# EAGLE design Adafruit RGB Matrix Bonnet (EAGLE 6.4)
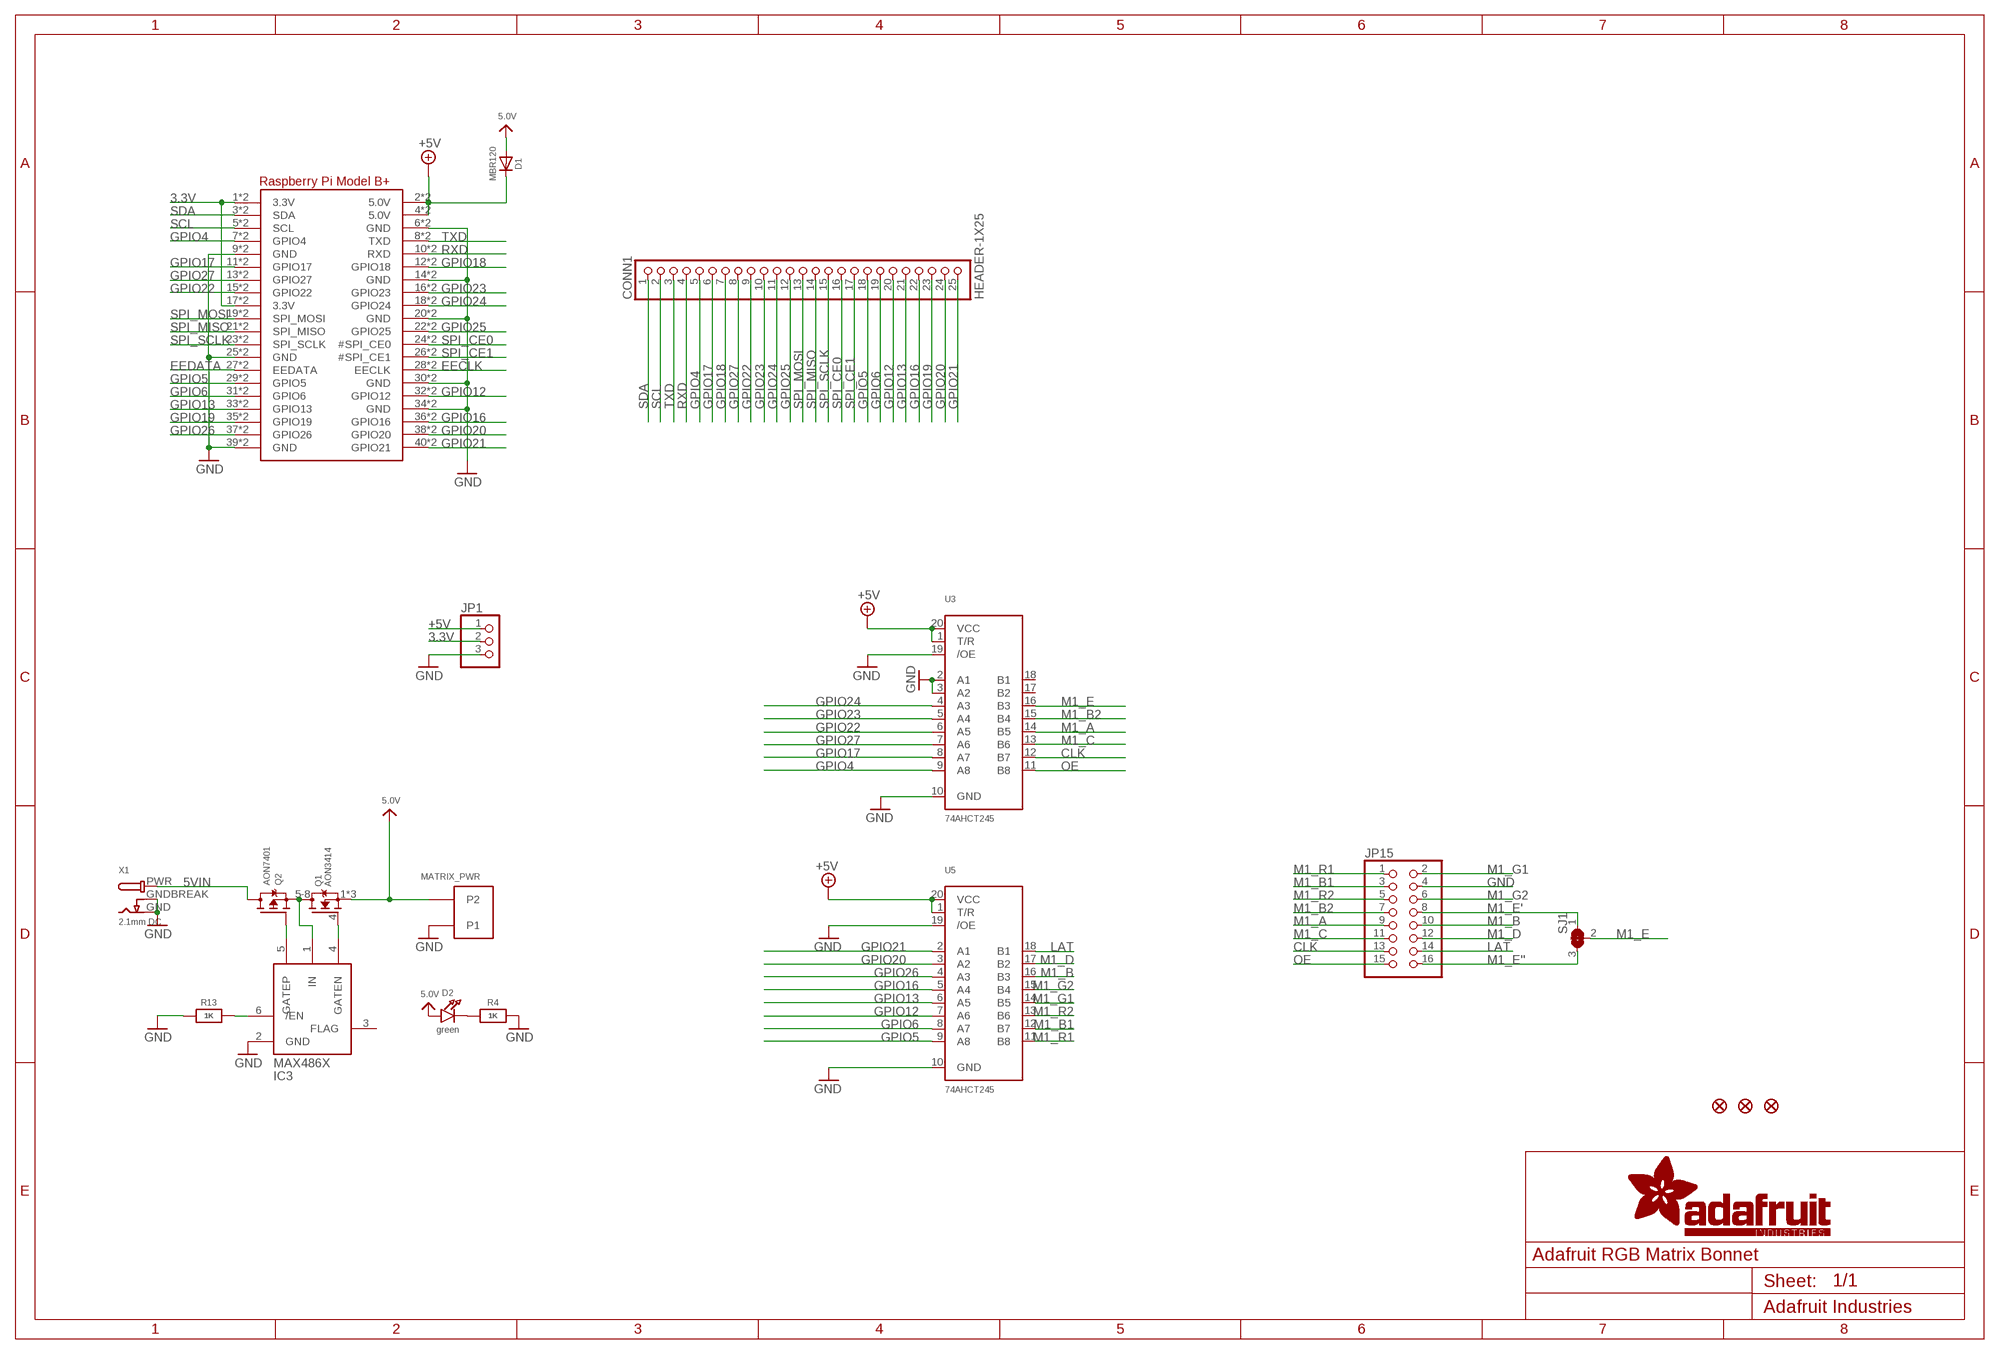
[diagram p0: schematic, sheet 1]

## Parts
CONN1  HEADER-1X25  [1X25_ROUND_70MIL]
D1  MBR120  DIODESOD-123  [SOD-123]
D2  green  LED0805_NOOUTLINE  [CHIPLED_0805_NOOUTLINE]
FID1  FIDUCIAL_1MM  [FIDUCIAL_1MM]
FID2  FIDUCIAL_1MM  [FIDUCIAL_1MM]
FID3  FIDUCIAL_1MM  [FIDUCIAL_1MM]
IC3  MAX4866T  MAX486X/SOT  [SOT23-6]
JP1  HEADER-1X376MIL  [1X03_ROUND_76]
JP15  HEADER-2X8_SHROUDED  [2X08_SHROUDED]
MATRIX_PWR  PINHEAD  [TERMBLOCK508]
Q1  AON3414  MOSFET-NPOWERPAK-1212-8  [POWERPAK-1212-8]
Q2  AON7401  MOSFET-P-POWERDI3333  [POWERDI3333]
R4  1K  RESISTOR0805_NOOUTLINE  [0805-NO]
R13  1K  RESISTOR0805_NOOUTLINE  [0805-NO]
RPI1  RASPBERRYPI_BPLUS_BONNET_THMSMT  [PI_BONNET_THMSMT]
SJ1  SOLDERJUMPER_2WAY  [SOLDERJUMPER_2WAY_OPEN_NOPASTE]
U3  74AHCT245  74LCX245  [TSSOP20]
U5  74AHCT245  74LCX245  [TSSOP20]
X1  2.1mm DC  DCBARRELPTH  [DCJACK_2MM_PTH]

## Nets
3.3V: JP1.2 RPI1.1(3.3V) RPI1.17(3.3V) RPI1.S1(3.3V) RPI1.S17(3.3V)
5.0V: D1.A D2.A MATRIX_PWR.P$4(P2) Q1.1(S) Q1.2(S) Q1.3(S)
5VIN: Q2.5678(D) X1.PWR
+5V: D1.C JP1.1 RPI1.2(5.0V) RPI1.4(5.0V) RPI1.S2(5.0V) RPI1.S4(5.0V) U3.1(T/R) U3.20(VCC) U5.1(T/R) U5.20(VCC)
CLK: JP15.13 U3.12(B7)
EECLK: RPI1.28(EECLK) RPI1.S28(EECLK)
EEDATA: RPI1.27(EEDATA) RPI1.S27(EEDATA)
GND: IC3.2(GND) JP1.3 JP15.4 MATRIX_PWR.P$3(P1) R4.2 R13.1 RPI1.6(GND) RPI1.9(GND) RPI1.14(GND) RPI1.20(GND) RPI1.25(GND) RPI1.30(GND) RPI1.34(GND) RPI1.39(GND) RPI1.S6(GND) RPI1.S9(GND) RPI1.S14(GND) RPI1.S20(GND) RPI1.S25(GND) RPI1.S30(GND) RPI1.S34(GND) RPI1.S39(GND) U3.2(A1) U3.3(A2) U3.10(GND) U3.19(/OE) U5.10(GND) U5.19(/OE) X1.GND X1.GNDBREAK
GPIO4: CONN1.5 RPI1.7(GPIO4) RPI1.S7(GPIO4) U3.9(A8)
GPIO5: CONN1.18 RPI1.29(GPIO5) RPI1.S29(GPIO5) U5.9(A8)
GPIO6: CONN1.19 RPI1.31(GPIO6) RPI1.S31(GPIO6) U5.8(A7)
GPIO12: CONN1.20 RPI1.32(GPIO12) RPI1.S32(GPIO12) U5.7(A6)
GPIO13: CONN1.21 RPI1.33(GPIO13) RPI1.S33(GPIO13) U5.6(A5)
GPIO16: CONN1.22 RPI1.36(GPIO16) RPI1.S36(GPIO16) U5.5(A4)
GPIO17: CONN1.6 RPI1.11(GPIO17) RPI1.S11(GPIO17) U3.8(A7)
GPIO18: CONN1.7 RPI1.12(GPIO18) RPI1.S12(GPIO18)
GPIO19: CONN1.23 RPI1.35(GPIO19) RPI1.S35(GPIO19)
GPIO20: CONN1.24 RPI1.38(GPIO20) RPI1.S38(GPIO20) U5.3(A2)
GPIO21: CONN1.25 RPI1.40(GPIO21) RPI1.S40(GPIO21) U5.2(A1)
GPIO22: CONN1.9 RPI1.15(GPIO22) RPI1.S15(GPIO22) U3.6(A5)
GPIO23: CONN1.10 RPI1.16(GPIO23) RPI1.S16(GPIO23) U3.5(A4)
GPIO24: CONN1.11 RPI1.18(GPIO24) RPI1.S18(GPIO24) U3.4(A3)
GPIO25: CONN1.12 RPI1.22(GPIO25) RPI1.S22(GPIO25)
GPIO26: RPI1.37(GPIO26) RPI1.S37(GPIO26) U5.4(A3)
GPIO27: CONN1.8 RPI1.13(GPIO27) RPI1.S13(GPIO27) U3.7(A6)
LAT: JP15.14 U5.18(B1)
M1_A: JP15.9 U3.14(B5)
M1_B: JP15.10 U5.16(B3)
M1_B1: JP15.3 U5.12(B7)
M1_B2: JP15.7 U3.15(B4)
M1_C: JP15.11 U3.13(B6)
M1_D: JP15.12 U5.17(B2)
M1_E: SJ1.2 U3.16(B3)
M1_E': JP15.8 SJ1.1
M1_E'': JP15.16 SJ1.3
M1_G1: JP15.2 U5.14(B5)
M1_G2: JP15.6 U5.15(B4)
M1_R1: JP15.1 U5.11(B8)
M1_R2: JP15.5 U5.13(B6)
N$1: IC3.6(/EN) R13.2
N$4: D2.C R4.1
N$5: IC3.1(IN) Q1.5-8(D) Q2.1(S) Q2.2(S) Q2.3(S)
N$6: IC3.4(GATEN) Q1.4(G)
N$7: IC3.5(GATEP) Q2.4(G)
OE: JP15.15 U3.11(B8)
RXD: CONN1.4 RPI1.10(RXD) RPI1.S10(RXD)
SCL: CONN1.2 RPI1.5(SCL) RPI1.S5(SCL)
SDA: CONN1.1 RPI1.3(SDA) RPI1.S3(SDA)
SPI_CE0: CONN1.16 RPI1.24(#SPI_CE0) RPI1.S24(#SPI_CE0)
SPI_CE1: CONN1.17 RPI1.26(#SPI_CE1) RPI1.S26(#SPI_CE1)
SPI_MISO: CONN1.14 RPI1.21(SPI_MISO) RPI1.S21(SPI_MISO)
SPI_MOSI: CONN1.13 RPI1.19(SPI_MOSI) RPI1.S19(SPI_MOSI)
SPI_SCLK: CONN1.15 RPI1.23(SPI_SCLK) RPI1.S23(SPI_SCLK)
TXD: CONN1.3 RPI1.8(TXD) RPI1.S8(TXD)
Unconnected: IC3.3(FLAG) U3.17(B2) U3.18(B1)

## Library data of the parts
CONN1 = microbuilder:HEADER-1X25
D1 = microbuilder:DIODE: Diode SMA Model Volts Amps Type Vf Ir Digikey # Notes SSA34-E3 40V 3A Schottky 480mV @ 3A 200uA @ 40V SSA34-E3/61TGITR-ND CDBA120-G 20V 1A Schottky 500mV @ 1A 500uA @ 20V 641-1014-6-ND REEL MBRA210 10V 2A Schottky 350mV @ 2A 700uA @ 10V MBRA210LT3 SOD-123 Model Volts Amps Type Vf Ir Order # Notes BAT54T1G 30V 200mA Schottky 800mV @ 200mA 2uA @ 25V BAT54T1GOSTR-ND B0530W 30V 500mA Schottky 430mV @ 500mA 130uA @ 30V B0530W-FDICT-ND REEL MBR120 20V 1A Schottky 340mV @ 1A MBR120VLSFT1GOSCT-ND SOD-323 Model Volts Amps Type Vf Ir Order # Notes PMEG2005EJ 20V 500mA Schottky 355mV @ 500mA 568-4110-1-ND ZLLS410 10V 570mA Schottky 380mV @ 570mA ZLLS410CT-ND 1N4148WS 75V 150mA Silicon/Simple 1V 1N4148WSFSCT-ND REEL SOD-523 Model Volts Amps Type Vf Ir Order # Notes BAT54XV2 30V 200mA Schottky 0.8V @ 100mA BAT54XV2CT-ND TB751S 30V 30mA Schottky RB751S-40TE61CT-ND SOT23-R/W (R = Solder Paste/Reflow Ovens, W = Hand-Soldering) Model Volts Amps Type Vf Ir Order # Notes BAT54FILM 40V 300mA Schottky 497-7162-1-ND POWERDI-5 Model Volts Amps Type Vf Ir Order # Notes PDS560 60V 5A Schottky 670mV @ 5A 150uA @ 60V PDS560DICT-ND
D2 = microbuilder:LED: LED 0603 - 0603 Surface Mount Package 2mA: Green LED - Low Power (3.9mcd, 2ma, 1.7Vf) - Digikey: 475-2709-2-ND Orange LED - Low Power (9.8mcd, 2ma, 1.8Vf) - Digikey: 475-1194-2-ND Red LED - Low Power (5mcd, 2ma, 1.8Vf) - Digikey: 475-1195-2-ND Yellow LED - Low Power (7mcd, 2ma, 1.8Vf) - Digikey: 475-1196-2-ND 5mA: Blue LED - Low Power (17mcd, 5ma, 2.9Vf) - Digikey: LNJ937W8CRACT-ND 0805 - 0805 Surface Mount Package 2mA: Red LED (8.8mcd, 2mA, 1.8Vf, Clear) - Low Power [Digikey: 475-2510-1-ND] Green LED (5mcd, 2mA, 1.8Vf, Clear) - Low Power [Digikey: 475-2730-1-ND] Yellow LED (11.3mcd, 2mA, 1.8Vf, Clear) - Low Power [Digikey: 475-2555-1-ND] 20mA: Red LED (104mcd, 20mA, Diffused) - LS R976 [Digikey: 475-1278-6-ND] Red LED (12mcd, 20mA, 2.0Vf, Clear) - APT2012EC [Digikey: 754-1128-1-ND] Green LED (15mcd, 20mA, 2.2Vf, Clear) - APT2012GC [Digikey: 754-1131-1-ND] Orange LED (160mcd, 20mA, 2.1Vf, Clear) - APT2012SECK [Digikey: 754-1130-1-ND] 1206 - 1206 Surface Mount Package Green LED (26mcd, 20mA, Diffused) - LG N971 [Digikey: 475-1407-6-ND] Red LED (15mcd, 20mA, Diffused) - LH N974 [Digikey: 475-1416-6-ND] Cree - Cree High-Power Surface Mount LEDs XPEBWT-L1-0000-00D50 - White 111lm 350mA 2.9Vf 6200K 110° XTEAWT-00-0000-00000LEE3 - White 114lm 350mA 2.85Vf 5000K 115° Everlight - Everlight 45-21 Series Surface Mount LEDs 45-21/QK2C-B2832AC2CB2/2T - Warm White 2000mcd 20mA 3.25Vf 3050K 120° 45-21/LK2C-B38452C4CB2/2T - Nuetral White 2000mcd 20mA 3.25Vf 4150K 120° 45-21/LK2C-B50634C6CB2/2T - Cold White 2200mcd 20mA 3.25Vf 5650K 120° PLCC2 Reverse Mount LS T77K-J1L2-1-0-2-R18-Z - Red 11.25mcd 2mA 1.8Vf 630nm 120° LO T77K-L1M2-24-Z - Orange 19.6mcd 2mA 1.8Vf 606nm 120° LY T77K-K2M1-26-Z - Yellow 15.7mcd 2mA 1.8Vf 587nm 120°
FID1-FID3 = microbuilder:FIDUCIAL: Fiducial Alignment Points Various fiducial points for machine vision alignment.; BOM: EXCLUDE
IC3 = adafruit:MAX486X
JP1 = microbuilder:HEADER-1X3: PIN HEADER
JP15 = microbuilder:HEADER-2X8
MATRIX_PWR = mshield:PINHEAD
Q1 = microbuilder:MOSFET-N: N-Channel Mosfet LEGEND VDS: Voltage Drain-Source ID: Drain Current RDS(ON): Drain-Source On-State Resistance VGS(TH): Gate-Source Threshold Voltage CISS: Drain-Source Input Capacitance SOT-23 Name VDS ID RDS(ON) VGS(TH) CISS Order Number 2N7002E 60V 260mA 2.5 Ohm 2.5V @ 250uA 26.7pF @ 25V 2N7002ET1GOSTR-ND BSH103 30V 850mA 400 mOhm 400mV @ 1mA 83pF @ 24V BSH103,235-ND BSS138 60V 320mA 1.6 Ohm 1.5V @ 250uA 50pF @ 10V Mouser: 771-BSS138PW115 DMN2075U-7 20V 4.2A 38 mOhm 1V @ 250 uA 594.3pF @ 10V DMN2075U-7DICT-ND * BSS138 good choice for I2C level-shifting POWERPAK 1212-8 Name VDS ID RDS(ON) VGS(TH) CISS Order Number Si7308DN 60V 6A 58 mOhm 3V @ 250uA 665pF @ 15V SI7308DN-T1-E3CT-ND
Q2 = microbuilder:MOSFET-P: P-Channel Mosfet LEGEND VDS: Voltage Drain-Source ID: Drain Current RDS(ON): Drain-Source On-State Resistance VGS(TH): Gate-Source Threshold Voltage CISS: Drain-Source Input Capacitance SOT-23 Name VDS ID RDS(ON) VGS(TH) CISS Order Number IRLML5103 30V 760mA 600 mOhm -- 75pF @ 25V Digikey: IRLML5103PBFCT-ND IRLML6401 12V 4.3A 50 mOhm 950mV @ 250µA 830pF @ 10V Digikey: IRLML6401PBFTR-ND NTR0202PL 20V 400mA 800 mOhm 2.3V @ 250uA 70pF @ 5V Digikey: NTR0202PLT1GOSTR-ND NTR4101PT1G 20V 1.8A 85 mOhm 1.2V @ 250uA 675pF @ 10V Digikey: NTR4101PT1GOSCT-ND DMP2004K 20V 600mA 900 mOhm 1V @ 250uA 175pF @ 16V Digikey: DMP2004KDICT-ND PMV65XP 20V 3.9A 76 mOhm 950mV @ 1mA 725pF @ 20V Digikey: 568-2358-2-ND TO-252 Name VDS ID RDS(ON) VGS(TH) CISS Order Number AOD417 30V 25A 34 mOhm 3V @ 250µA 920pF @ 15V Digikey: 785-1106-2-ND PowerPak Name VDS ID RDS(ON) VGS(TH) CISS Order Number AON7401 30V 12A 14 mOhm 3V @ 250µA 2600pF @ 15V Digikey: 785-1302-1-ND
R4 R13 = microbuilder:RESISTOR: Resistors For new designs, use the packages preceded by an '_' character since they are more reliable: The following footprints should be used on most boards: _0402 - Standard footprint for regular board layouts _0603 - Standard footprint for regular board layouts _0805 - Standard footprint for regular board layouts _1206 - Standard footprint for regular board layouts For extremely tight-pitch boards where space is at a premium, the following 'micro-pitch' footprints can be used (smaller pads, no silkscreen outline, etc.): _0402MP - Micro-pitch footprint for very dense/compact boards _0603MP - Micro-pitch footprint for very dense/compact boards _0805MP - Micro-pitch footprint for very dense/compact boards _1206MP - Micro-pitch footprint for very dense/compact boards
RPI1 = microbuilder:RASPBERRYPI_BPLUS
SJ1 = microbuilder:SOLDERJUMPER_2WAY: 2-Way Solder Jumper
U3 U5 = microbuilder:74LCX245: 74LCX245MTC - 5.0V Tolerant Bi-Directional Buffer Can be used to interface 5.0V logic to 2.5 or 3.3V devices Digikey: 74LCX245MTCXTR-ND Mouser: 512-74LCX245MTCX
X1 = microbuilder:DCBARREL: DC Barrel Jack DCJACK_1.3MM_PTH - Through Hole 1.3mm Jack (4UConnector: 05536) DCJACK_2MM_PTH - Through Hole 2.0/2.1 Jack (4UConnector: 05537) DCJACK_2MM_SMT - SMT 2.0/2.1mm Jack(4UConnector: 03267)

## Board
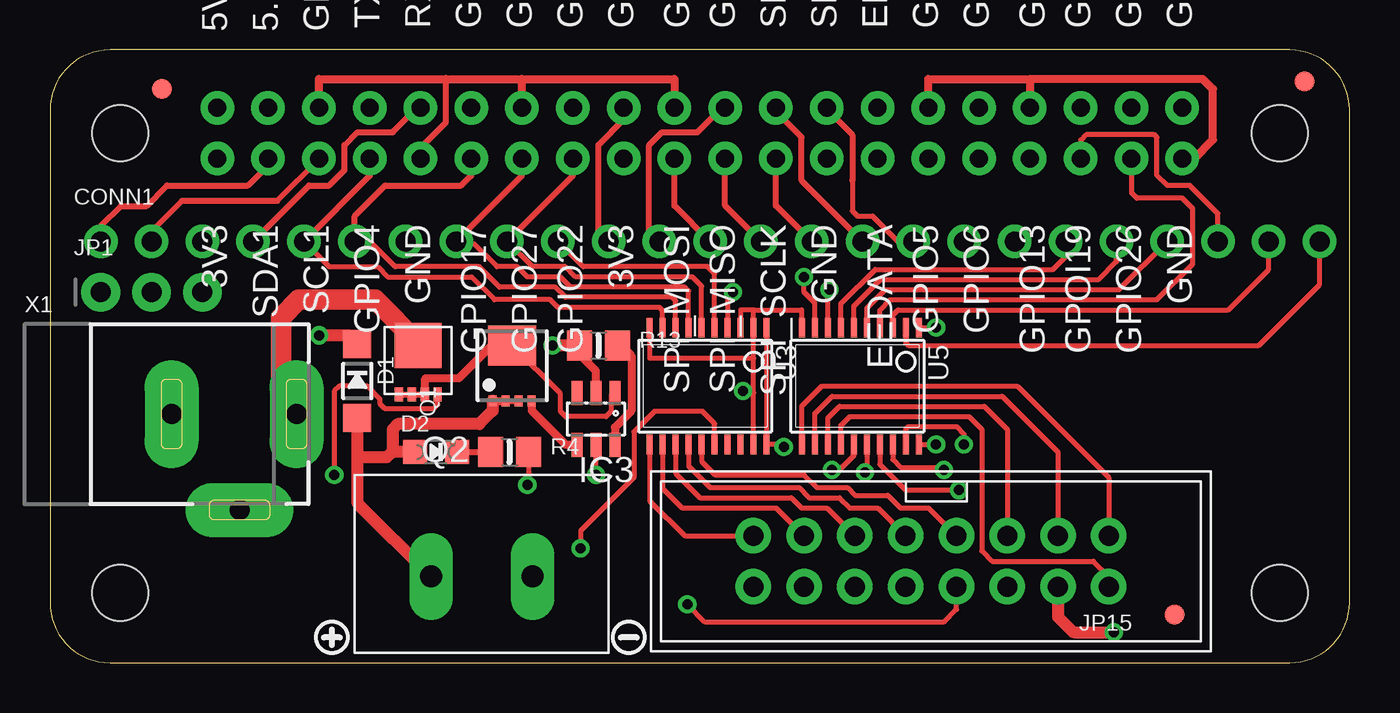
[diagram p1: board, top side]
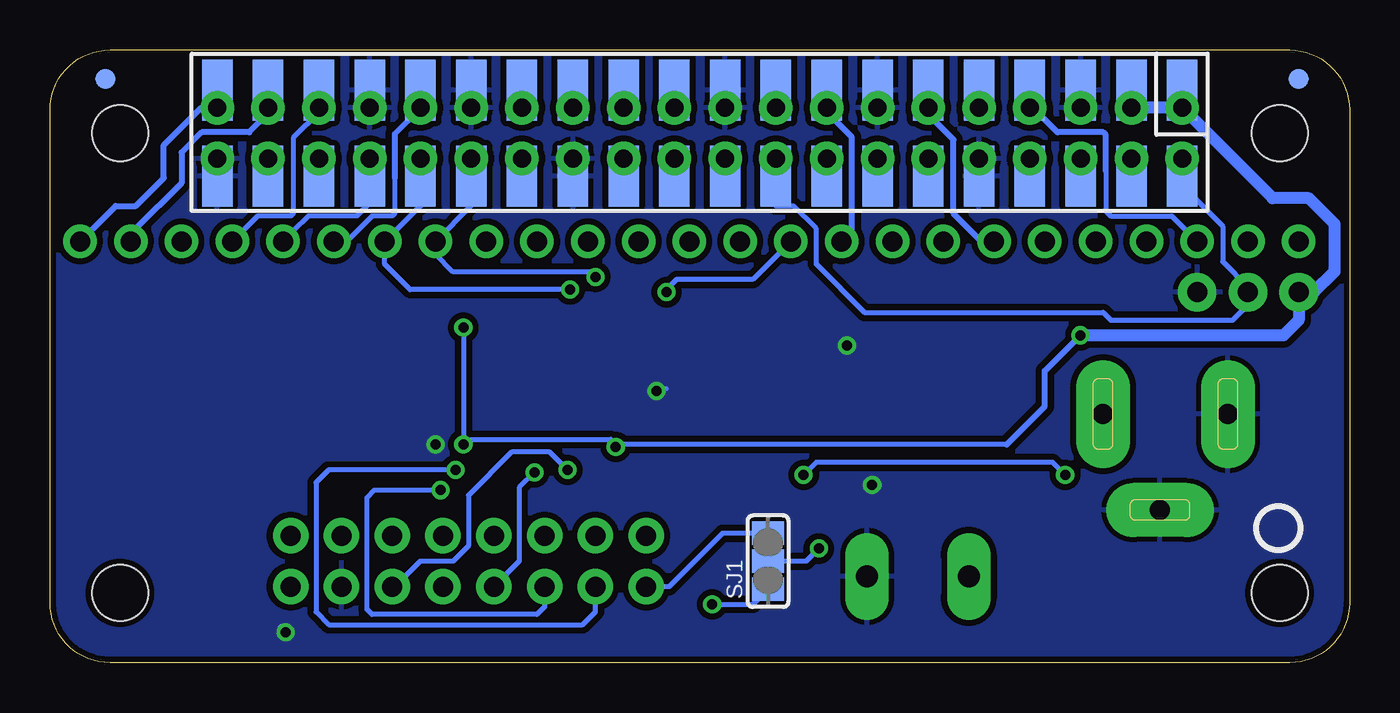
[diagram p2: board, bottom side, seen from below]

Size 65 x 30.66 mm. Coordinates in mm from the lower left corner, seen from the top.
Copper layers (1*16): Top 0.035mm / dielectric 1.5mm / Bottom 0.035mm
Design rules "adafruit *": minimum track width 8mil, minimum drill 15.5mil, track to track 8mil, track to pad 8mil, pad to pad 8mil, via to via 8mil, smd to smd 8mil, copper to edge 10mil, drill to drill 8mil, minimum pad ring 10mil, minimum via ring 8mil, stop-mask expansion 2mil, vias tented up to drill 20mil, thermal gap 10mil

### Footprints (pad centres in the part's own frame; a part is rotated, then mirrored left to right if it is on the bottom)
1X25_ROUND_70MIL = drill 1 pad 1.676: 1 -30.48,0; 2 -27.94,0; 3 -25.4,0; 4 -22.86,0; 5 -20.32,0; 6 -17.78,0; 7 -15.24,0; 8 -12.7,0; 9 -10.16,0; 10 -7.62,0; 11 -5.08,0; 12 -2.54,0; 13 0,0; 14 2.54,0; 15 5.08,0; 16 7.62,0; 17 10.16,0; 18 12.7,0; 19 15.24,0; 20 17.78,0; 21 20.32,0; 22 22.86,0; 23 25.4,0; 24 27.94,0; 25 30.48,0
SOD-123 = smd 1.4 x 1.4: A 1.85,0; C -1.85,0
CHIPLED_0805_NOOUTLINE = smd 1.2 x 1.2: A 0,-1.05; C 0,1.05
FIDUCIAL_1MM = smd 1 x 1: 1 0,0
SOT23-6 = smd 0.55 x 1.2: 1 -0.95,-1.3; 2 0,-1.3; 3 0.95,-1.3; 4 0.95,1.3; 5 0,1.3; 6 -0.95,1.3
1X03_ROUND_76 = drill 1 pad 1.93: 1 -2.54,0; 2 0,0; 3 2.54,0
2X08_SHROUDED = drill 1 pad 1.778: 1 -8.89,-1.27; 2 -8.89,1.27; 3 -6.35,-1.27; 4 -6.35,1.27; 5 -3.81,-1.27; 6 -3.81,1.27; 7 -1.27,-1.27; 8 -1.27,1.27; 9 1.27,-1.27; 10 1.27,1.27; 11 3.81,-1.27; 12 3.81,1.27; 13 6.35,-1.27; 14 6.35,1.27; 15 8.89,-1.27; 16 8.89,1.27
TERMBLOCK508 = drill 1.1 pad 2.184 long: P$3 -2.54,0; P$4 2.54,0
POWERPAK-1212-8 = smd 0.4 x 0.55: 1 -0.975,-1.75; 2 -0.325,-1.75; 3 0.325,-1.75; 4 0.975,-1.75 | smd 2.4 x 2: 5-8 0,1.005
POWERDI3333 = smd 0.7 x 0.42: 1 -1.7,0.975; 2 -1.7,0.325; 3 -1.7,-0.325; 4 -1.7,-0.975 | smd 2.25 x 2.35: 5678 0.75,0
0805-NO = smd 1.24 x 1.5: 1 -0.95,0; 2 0.95,0
PI_BONNET_THMSMT = drill 0.9 pad 1.676: 1 8.37,25.23; 2 8.37,27.77; 3 10.91,25.23; 4 10.91,27.77; 5 13.45,25.23; 6 13.45,27.77; 7 15.99,25.23; 8 15.99,27.77; 9 18.53,25.23; 10 18.53,27.77; 11 21.07,25.23; 12 21.07,27.77; 13 23.61,25.23; 14 23.61,27.77; 15 26.15,25.23; 16 26.15,27.77; 17 28.69,25.23; 18 28.69,27.77; 19 31.23,25.23; 20 31.23,27.77; 21 33.77,25.23; 22 33.77,27.77; 23 36.31,25.23; 24 36.31,27.77; 25 38.85,25.23; 26 38.85,27.77; 27 41.39,25.23; 28 41.39,27.77; 29 43.93,25.23; 30 43.93,27.77; 31 46.47,25.23; 32 46.47,27.77; 33 49.01,25.23; 34 49.01,27.77; 35 51.55,25.23; 36 51.55,27.77; 37 54.09,25.23; 38 54.09,27.77; 39 56.63,25.23; 40 56.63,27.77 | smd 1 x 1 bottom: 41 2.54,29.21; 42 62.23,29.21 | smd 1.524 x 3.048 bottom: S1 8.37,24.339; S2 8.37,28.657; S3 10.91,24.339; S4 10.91,28.657; S5 13.45,24.339; S6 13.45,28.657; S7 15.99,24.339; S8 15.99,28.657; S9 18.53,24.339; S10 18.53,28.657; S11 21.07,24.339; S12 21.07,28.657; S13 23.61,24.339; S14 23.61,28.657; S15 26.15,24.339; S16 26.15,28.657; S17 28.69,24.339; S18 28.69,28.657; S19 31.23,24.339; S20 31.23,28.657; S21 33.77,24.339; S22 33.77,28.657; S23 36.31,24.339; S24 36.31,28.657; S25 38.85,24.339; S26 38.85,28.657; S27 41.39,24.339; S28 41.39,28.657; S29 43.93,24.339; S30 43.93,28.657; S31 46.47,24.339; S32 46.47,28.657; S33 49.01,24.339; S34 49.01,28.657; S35 51.55,24.339; S36 51.55,28.657; S37 54.09,24.339; S38 54.09,28.657; S39 56.63,24.339; S40 56.63,28.657 | hole 2.8: 3.5,26.5; 61.5,26.5; 61.5,3.5; 3.5,3.5
SOLDERJUMPER_2WAY_OPEN_NOPASTE = smd 1.168 x 1.6: 1 -1.397,0; 2 0,0; 3 1.397,0
TSSOP20 = smd 0.305 x 0.991: 1 -3.075,-2.918; 2 -2.425,-2.918; 3 -1.775,-2.918; 4 -1.125,-2.918; 5 -0.475,-2.918; 6 0.175,-2.918; 7 0.825,-2.918; 8 1.475,-2.918; 9 2.125,-2.918; 10 2.775,-2.918; 11 2.775,2.918; 12 2.125,2.918; 13 1.475,2.918; 14 0.825,2.918; 15 0.175,2.918; 16 -0.475,2.918; 17 -1.125,2.918; 18 -1.775,2.918; 19 -2.425,2.918; 20 -3.075,2.918
DCJACK_2MM_PTH = drill 1 pad 2.7 long: GND 7.35,0; GNDBREAK 10.75,-4.8; PWR 13.6,0

### Placement (x,y rotation side)
CONN1  33.02,21.08 0 top
D1  15.37,14.1 270 top
D2  19.3,10.54 270 top
FID1  5.59,28.7 0 top
FID2  56.26,2.41 0 top
FID3  62.74,29.08 0 top
IC3  27.3,12.19 180 top
JP1  5.08,18.54 0 top
JP15  44.07,5.08 180 top
MATRIX_PWR  21.59,4.32 180 top
Q1  23.11,14.86 0 top
Q2  18.41,15.11 90 top
R4  22.99,10.54 0 top
R13  27.43,15.88 0 top
RPI1  0,0 0 top
SJ1  29.08,5.08 90 bottom
U3  32.77,13.84 180 top
U5  40.39,13.84 180 top
U$1  [BONNET_MATRIX_TOP]  0,0 0 top
U$3  [PCBFEAT-REV-056]  3.56,6.73 0 bottom
U$6  [BONNET_MATRIX_BOT]  65.02,0 0 bottom
U$10  [SYMBOL_PLUS]  14.1,1.27 0 top
U$11  [SYMBOL_MINUS]  28.96,1.27 0 top
X1  -1.27,12.45 0 top

### Tracks (layer width: path | path; a pad name or v marks a point on that pad's centre or on a via)
3.3V
  Bottom 0.254: RPI1.1 8.37,23.86 6.35,21.84 6.35,20.07 5.08,18.8 JP1.2 5.08,17.91 5.84,17.14 11.94,17.14 12.32,17.53 24.26,17.53 26.67,19.94 26.67,21.72 27.81,22.86 28.7,22.86 28.7,25.22 RPI1.17
  Bottom 0.406: 8.37,23.86 8.38,23.86 8.38,24.89 | RPI1.S1 | RPI1.S1 RPI1.1 | RPI1.S17 | RPI1.S17 RPI1.17
5.0V
  Top 0.305: Q1.2 Q1.3
  Top 0.406: Q1.1 Q1.2
  Top 0.61: D1.A 15.37,10.29 | 15.37,10.29 15.37,8 MATRIX_PWR.P$4 | Q1.1 22.14,12.61 21.46,11.94 17.4,11.94 17.14,11.68 17.14,10.57 | 15.37,10.29 16.86,10.29 17.14,10.57 | D2.A 17.18,10.54 17.14,10.57
5VIN
  Top 1.016: X1.PWR 11.56,13.22 11.56,17.27 12.45,18.16 16.26,18.16 18.41,16 Q2.5678
+5V  (via drill 0.5)
  Top 0.254: U3.1 U3.20 36.57,10.93 v36.7,10.79 | U5.20 v44.32,10.92 | U5.1 v44.32,16.76
  Top 0.61: D1.C 14.93,16.38 v13.46,16.38
  Bottom 0.254: v44.32,16.76 v44.32,10.92 44.32,11.18 36.96,11.18 36.7,10.92 v36.7,10.79 36.58,10.92 17.14,10.92
  Bottom 0.305: 17.14,10.92 15.24,12.83 15.24,14.61 v13.46,16.38
  Bottom 0.406: RPI1.S4 | RPI1.S4 RPI1.4 | RPI1.S2 | RPI1.S2 RPI1.2
  Bottom 0.61: RPI1.4 RPI1.2 3.84,23.24 2.03,23.24 0.76,21.97 0.76,19.56 1.78,18.54 JP1.1 2.54,17.14 3.3,16.38 v13.46,16.38
CLK
  Top 0.254: U3.12 30.64,8.73 31.62,7.75 36.32,7.75 JP15.13
EECLK
  Bottom 0.406: RPI1.S28 | RPI1.S28 RPI1.28
EEDATA
  Bottom 0.406: RPI1.S27 | RPI1.S27 RPI1.27
GND  (via drill 0.5)
  Top 0.254: U3.3 34.54,17.65 35.19,17.65 | U3.19 35.19,13.51 | 35.19,13.51 35.19,15.24 | 35.19,15.24 U3.2 35.19,17.65 | 35.19,17.65 37.59,17.65 37.59,16.76 U5.10 | U3.10 29.99,15.24 35.19,15.24 | U5.19 42.81,11.7 42.93,11.81 45.34,11.81 45.72,11.43 v45.72,10.92 | 35.19,13.51 35.11,13.59 v34.67,13.59 | R4.2 23.94,8.95 v23.88,8.89
  Top 0.305: RPI1.9 18.53,25.77 19.81,27.05 19.81,29.21
  Top 0.406: RPI1.30 43.93,29.21 49.02,29.21 | 49.02,29.21 49.02,27.77 RPI1.34 | RPI1.14 23.61,29.21 | 23.61,29.21 31.23,29.21 RPI1.20 | RPI1.6 13.45,29.21 19.81,29.21 23.61,29.21 | RPI1.39 57.23,25.23 58.17,26.16 58.17,28.7 57.66,29.21 49.02,29.21 | IC3.2 27.3,14.61 26.48,15.43 R13.1
  Top 0.61: JP15.4 50.42,2.29 51.18,1.52 v53.21,1.52 | R13.1 v25.15,15.88
  Bottom 0.254: v45.72,10.92 45.59,10.92 | v34.67,13.59 34.54,13.72 34.16,13.72
  Bottom 0.305: v23.88,8.89 23.88,8.76
  Bottom 0.61: v53.21,1.52 53.34,1.65
  pour Bottom (isolate 0.305): 0,30.73 0,0 65.02,0 65.02,30.73
GPIO4
  Top 0.254: U3.9 30.64,17.62 30.48,17.78 25.4,17.78 25.02,18.16 22.23,18.16 21.08,19.3 16.89,19.3 16.38,19.81 13.97,19.81 CONN1.5
  Top 0.305: CONN1.5 15.99,24.37 RPI1.7
  Bottom 0.254: RPI1.S7 RPI1.7 | RPI1.7
GPIO5  (via drill 0.5)
  Top 0.254: U5.9 38.26,18 37.72,18.54 v37.72,19.3
  Bottom 0.254: v37.72,19.3 37.97,19.56 44.83,19.56 45.72,20.45 CONN1.18 43.93,22.87 RPI1.S29
  Bottom 0.406: RPI1.S29 43.94,24.34 43.94,24.38 43.93,24.38 RPI1.29
GPIO6  (via drill 0.5)
  Top 0.254: U5.8 38.91,18.59 v38.99,18.67
  Bottom 0.254: v38.99,18.67 46.99,18.67 48.26,19.94 CONN1.19 46.47,22.87
  Bottom 0.305: RPI1.31 46.47,22.87
  Bottom 0.406: RPI1.S31 | RPI1.S31 RPI1.31
GPIO12
  Top 0.254: U5.7 39.56,17.97 41.27,19.68 50.16,19.68 50.8,20.32 CONN1.20
  Bottom 0.254: 47.75,24.26 47.75,22.48 47.88,22.35 48.9,22.35 50.16,21.08 CONN1.20 | 47.75,26.45 46.47,27.73 RPI1.32
  Bottom 0.305: 47.75,26.45 47.75,24.26
  Bottom 0.406: RPI1.S32 | RPI1.S32 RPI1.32
GPIO13
  Top 0.254: U5.6 40.21,17.86 41.53,19.18 52.45,19.18 53.34,20.07 CONN1.21
  Bottom 0.254: 52.83,21.59 52.07,22.35 49.66,22.35 49.01,23 RPI1.S33
  Bottom 0.305: 52.83,21.59 CONN1.21
  Bottom 0.406: RPI1.S33 | RPI1.S33 RPI1.33
GPIO16
  Top 0.254: U5.5 40.86,17.75 41.78,18.67 53.47,18.67 CONN1.22
  Bottom 0.254: 51.55,27.55 52.83,26.27 52.83,22.48 52.96,22.35 54.61,22.35 CONN1.22
  Bottom 0.305: RPI1.36 51.55,27.55
  Bottom 0.406: RPI1.S36 | RPI1.S36 RPI1.36
GPIO17
  Top 0.254: U3.8 31.29,18.11 31.11,18.29 25.78,18.29 25.27,18.8 22.48,18.8 21.46,19.81 17.27,19.81 16,21.08 CONN1.6
  Top 0.305: CONN1.6 15.24,22.35 16.76,23.88 20.57,23.88 21.07,24.37 RPI1.11
  Bottom 0.406: RPI1.S11 | RPI1.S11 RPI1.11
GPIO18
  Bottom 0.305: RPI1.12 21.07,27.42 19.81,26.16 19.81,22.48 18.41,21.08 CONN1.7
  Bottom 0.406: RPI1.S12 | RPI1.S12 RPI1.12
GPIO19
  Top 0.254: CONN1.23 58.42,22.48 57.02,23.88 55.88,23.88 55.37,24.38 55.37,26.29 55.24,26.42 51.82,26.42 51.55,26.15 RPI1.35
  Bottom 0.406: RPI1.S35 | RPI1.S35 RPI1.35
GPIO20
  Top 0.254: U5.3 42.16,17.4 42.42,17.65 58.93,17.65 60.96,19.68 CONN1.24
  Bottom 0.254: 60.71,21.72 60.96,21.46 CONN1.24
  Bottom 0.305: 60.71,21.72 58.42,24 58.42,25.53 57.4,26.54 55.03,26.54 54.09,27.48 RPI1.38
  Bottom 0.406: RPI1.S38 | RPI1.S38 RPI1.38
GPIO21
  Top 0.254: U5.2 42.81,15.99 42.93,15.88 60.45,15.88 63.5,18.92 CONN1.25
  Bottom 0.305: CONN1.25 61.72,22.86 60.71,22.86 59.31,24.26 59.31,25.91 57.45,27.77 RPI1.40
  Bottom 0.406: RPI1.S40 | RPI1.S40 RPI1.40
GPIO22
  Top 0.254: U3.6 32.59,18.84 32.13,19.3 26.29,19.3 25.78,19.81 24.13,19.81 CONN1.9
  Top 0.305: CONN1.9 26.15,24.37 RPI1.15
  Bottom 0.406: RPI1.S15 | RPI1.S15 RPI1.15
GPIO23
  Top 0.254: U3.5 33.24,19.46 32.89,19.81 26.67,19.81 CONN1.10
  Bottom 0.305: CONN1.10 24.89,21.59 24.89,26.29 26.15,27.55 RPI1.16
  Bottom 0.406: RPI1.S16 | RPI1.S16 RPI1.16
GPIO24  (via drill 0.5)
  Top 0.254: v34.16,18.54 34.16,18.41 33.89,18.14 U3.4
  Top 0.305: CONN1.11 27.43,21.59 27.43,25.91 28.69,27.17 RPI1.18
  Bottom 0.254: CONN1.11 29.84,19.18 33.66,19.18 34.16,18.67 v34.16,18.54
  Bottom 0.406: RPI1.S18 | RPI1.S18 RPI1.18
GPIO25
  Top 0.305: CONN1.12 29.97,21.59 29.97,25.91 30.61,26.54 32.38,26.54 33.61,27.77 RPI1.22
  Bottom 0.406: RPI1.S22 | RPI1.S22 RPI1.22
GPIO26
  Top 0.254: U5.4 41.51,17.64 42.04,18.16 55.37,18.16 57.15,19.94 57.15,22.73 56.64,23.24 54.36,23.24 54.1,23.5 54.1,25.22 RPI1.37
  Bottom 0.406: RPI1.S37 | RPI1.S37 RPI1.37
GPIO27
  Top 0.254: U3.7 31.94,18.61 31.75,18.8 26.04,18.8 25.53,19.3 23.88,19.3 23.37,19.81 22.35,19.81 21.21,20.95 20.45,20.95 CONN1.8
  Top 0.305: CONN1.8 23.61,24.37 RPI1.13
  Bottom 0.406: RPI1.S13 | RPI1.S13 RPI1.13
LAT  (via drill 0.5)
  Top 0.254: U5.18 42.16,10.16 42.55,9.78 44.58,9.78 v44.7,9.65
  Bottom 0.254: JP15.14 37.72,2.54 38.35,1.91 51.05,1.91 51.69,2.54 51.69,9.02 51.05,9.65 v44.7,9.65
M1_A
  Top 0.254: U3.14 31.94,9.84 33.02,8.76 37.47,8.76 37.97,8.26 39.5,8.26 40.01,7.75 41.4,7.75 JP15.9
M1_B  (via drill 0.5)
  Top 0.254: U5.16 40.86,9.62 v40.77,9.53
  Bottom 0.254: v40.77,9.53 41.53,8.76 41.53,5.08 JP15.10
M1_B1
  Top 0.254: U5.12 38.26,12.48 39.12,13.34 47.62,13.34 50.42,10.54 JP15.3
M1_B2
  Top 0.254: U3.15 32.59,10.08 33.27,9.4 37.72,9.4 38.35,8.76 39.88,8.76 40.26,8.38 41.91,8.38 42.55,7.75 43.94,7.75 JP15.7
M1_C
  Top 0.254: U3.13 31.29,9.48 32.51,8.26 37.08,8.26 37.59,7.75 38.86,7.75 JP15.11
M1_D  (via drill 0.5)
  Top 0.254: U5.17 41.51,9.92 42.8,8.64 v45.47,8.64
  Bottom 0.254: JP15.12 40.26,2.79 40.64,2.41 48.9,2.41 49.15,2.67 49.15,8.26 48.77,8.64 v45.47,8.64
M1_E  (via drill 0.5)
  Top 0.254: U3.16 33.24,11.97 32.64,12.57 30.23,12.57 29.21,11.56 29.21,9.27 26.54,6.6 v26.54,5.71
  Bottom 0.254: v26.54,5.71 27.18,5.08 SJ1.2
M1_E'  (via drill 0.5)
  Top 0.254: JP15.8 45.34,2.67 44.7,2.03 32.77,2.03 v31.88,2.92
  Bottom 0.254: v31.88,2.92 29.84,2.92 SJ1.1
M1_E''
  Bottom 0.254: SJ1.3 31.37,6.48 34.04,3.81 JP15.16
M1_G1
  Top 0.254: U5.14 39.56,11.88 40.01,12.32 45.97,12.32 46.61,11.68 46.61,5.59 47.12,5.08 52.2,5.08 52.96,4.32 JP15.2
M1_G2  (via drill 0.5)
  Top 0.254: U5.15 40.21,10.37 39.5,9.65 v39.12,9.65
  Bottom 0.254: v39.12,9.65 40.01,10.54 41.91,10.54 44.07,8.38 44.07,5.84 44.83,5.08 46.48,5.08 47.75,3.81 JP15.6
M1_R1
  Top 0.254: U5.11 37.61,12.85 38.61,13.84 48.39,13.84 52.96,9.27 JP15.1
M1_R2
  Top 0.254: U5.13 38.91,12.24 39.5,12.83 46.74,12.83 47.88,11.68 JP15.5
N$1
  Top 0.406: IC3.6 28.25,11.78 29.08,12.61 29.08,15.37 28.57,15.88 R13.2
N$4
  Top 0.305: D2.C R4.1
N$5
  Top 0.254: Q1.5-8 23.11,15.88 25.53,13.46 25.53,12.57 25.78,12.32 27.81,12.32 28.07,12.57 28.07,13.34 28.25,13.52 IC3.1
  Top 0.305: Q2.1 Q2.2 Q2.3
  Top 0.406: Q1.5-8 22.09,15.86 20.45,14.22 18.8,14.22 18.74,14.17 Q2.3
N$6
  Top 0.406: Q1.4 24.09,12.61 25.78,10.92 26.32,10.92 IC3.4
N$7  (via drill 0.5)
  Top 0.254: v27.3,9.4 IC3.5 | v14.22,9.4 14.22,13.59 14.48,13.84 15.88,13.84 16.51,13.21 16.51,12.95 16.76,12.7 19.18,12.7 19.39,12.91 Q2.4
  Bottom 0.254: v14.22,9.4 14.86,10.03 26.67,10.03 v27.3,9.4
OE
  Top 0.254: U3.11 29.99,8.11 31.75,6.35 JP15.15
RXD
  Top 0.305: CONN1.4 12.95,23.88 13.97,23.88 14.73,24.64 14.73,25.91 15.37,26.54 17.14,26.54 18.37,27.77 RPI1.10
  Bottom 0.406: RPI1.S10 | RPI1.S10 RPI1.10
SCL
  Top 0.254: 6.6,23.11 5.08,21.59 CONN1.2 | 11.37,23.11 13.45,25.2 RPI1.5
  Top 0.305: 6.6,23.11 11.37,23.11
  Bottom 0.406: RPI1.S5 | RPI1.S5 RPI1.5
SDA
  Top 0.254: 2.61,21.02 CONN1.1
  Top 0.305: CONN1.1 2.54,21.84 3.56,22.86 4.83,22.86 5.84,23.88 9.91,23.88 10.91,24.88 RPI1.3
  Bottom 0.406: RPI1.S3 | RPI1.S3 RPI1.3
SPI_CE0
  Top 0.305: CONN1.16 37.59,24.13 37.59,26.29 36.31,27.57 RPI1.24
  Bottom 0.406: RPI1.S24 | RPI1.S24 RPI1.24
SPI_CE1
  Top 0.254: 40.13,24.13 40.13,22.61 40.39,22.35 41.15,22.35 42.42,21.08 CONN1.17
  Top 0.305: RPI1.26 38.85,27.7 40.13,26.42 40.13,24.13
  Bottom 0.406: RPI1.S26 | RPI1.S26 RPI1.26
SPI_MISO
  Top 0.305: CONN1.14 33.77,22.87 RPI1.21
  Bottom 0.406: RPI1.S21 | RPI1.S21 RPI1.21
SPI_MOSI
  Top 0.305: CONN1.13 31.23,22.87 RPI1.19
  Bottom 0.406: RPI1.S19 | RPI1.S19 RPI1.19
SPI_SCLK
  Top 0.305: CONN1.15 36.31,22.87 RPI1.23
  Bottom 0.406: RPI1.S23 | RPI1.S23 RPI1.23
TXD
  Bottom 0.254: 12.19,24.64 12.19,22.61 11.94,22.35 8.89,22.35 CONN1.3
  Bottom 0.305: 12.19,24.64 12.19,26.42 12.32,26.54 14.61,26.54 15.83,27.77 RPI1.8
  Bottom 0.406: RPI1.S8 | RPI1.S8 RPI1.8

### Text on the board
tDocu: SDA | SCL | CLK | CE1 | TX | RX | 4 | 17 | 18 | 27 | 22 | 23 | 24 | 25 | MO | MI | CE0 | 5 | 6 | 12 | 13 | 16 | 19 | 20 | 21 | 5V | GND | OE | CLK | AdC | AdA | B2 | AdE | R1 | B1 | R2 | G1 | G2 | AdD | LAT | #26: AdB | RGB Matrix / Bonnet for / RaspberryPi | 5V OK | 5V In | 5V / Out | HUB75
bDocu: 5V | 3V | GND | #16 | E | #8